# EAGLE design pH-metr (EAGLE 6.1)
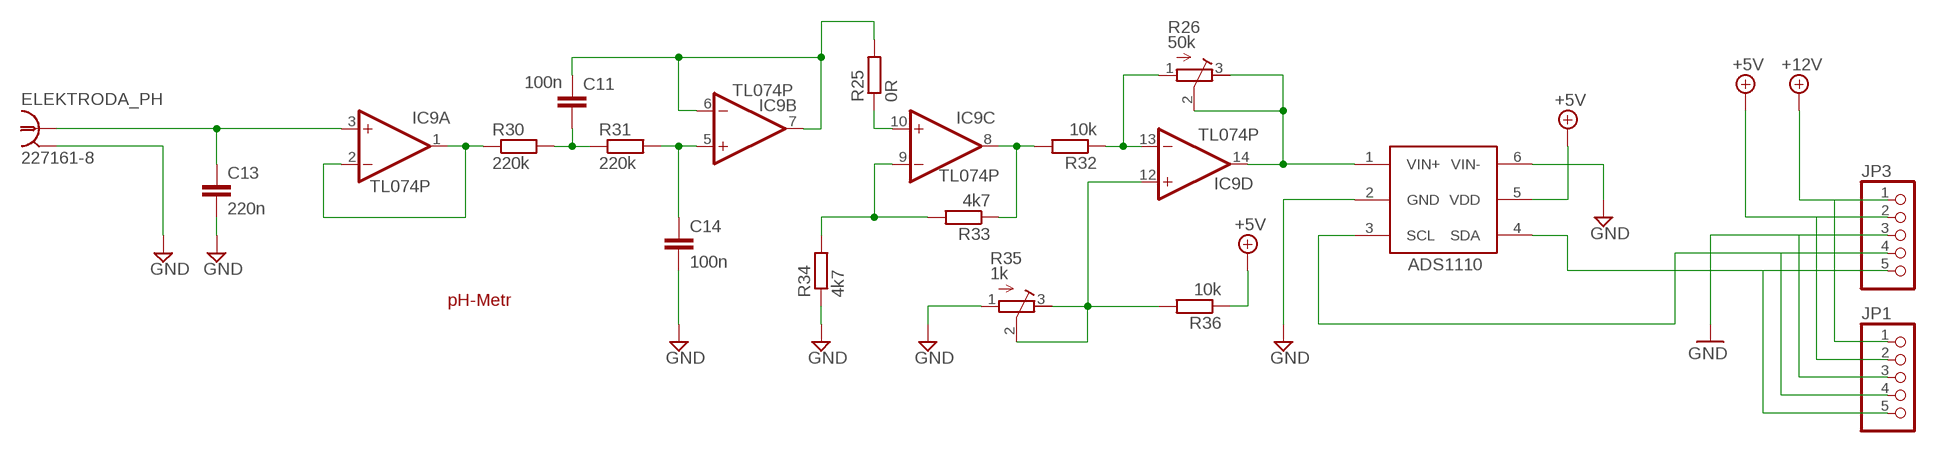
[diagram p0: schematic, sheet 1]

## Parts
C11  100n  C-EUC1206  [C1206]
C13  220n  C-EU050-025X075  [C050-025X075]
C14  100n  C-EUC1206  [C1206]
ELEKTRODA_PH  227161-8  [AMP_227161]
IC2  ADS1110  [SOT-23-6]
IC9  TL074P  [DIL14]
JP1  PINHD-1X5/90  [1X05/90]
JP3  PINHD-1X5/90  [1X05/90]
R25  0R  R-EU_R1206  [R1206]
R26  50k  R-TRIMM64X  [RTRIM64X]
R30  220k  R-EU_R1206  [R1206]
R31  220k  R-EU_R1206  [R1206]
R32  10k  R-EU_R1206  [R1206]
R33  4k7  R-EU_R1206  [R1206]
R34  4k7  R-EU_R1206  [R1206]
R35  1k  R-TRIMM64X  [RTRIM64X]
R36  10k  R-EU_R1206  [R1206]

## Nets
+5V: IC2.5(VDD) JP1.2 JP3.2 R36.1
+12V: JP1.1 JP3.1
GND: C13.2 C14.2 ELEKTRODA_PH.2(GND) IC2.2(GND) IC2.6(VIN-) JP1.3 JP3.3 R34.1 R35.1(A)
N$46: C13.1 ELEKTRODA_PH.1 IC9.3(A:+IN)
N$47: IC9.12(D:+IN) R35.2(S) R35.3(E) R36.2
N$51: IC9.10(C:+IN) R25.1
N$94: IC9.13(D:-IN) R26.1(A) R32.1
N$96: IC9.1(A:OUT) IC9.2(A:-IN) R30.1
N$100: C11.2 R30.2 R31.1
N$102: C14.1 IC9.5(B:+IN) R31.2
N$104: C11.1 IC9.6(B:-IN) IC9.7(B:OUT) R25.2
N$109: IC9.9(C:-IN) R33.2 R34.2
N$110: IC9.8(C:OUT) R32.2 R33.1
PHOUT: IC2.1(VIN+) IC9.14(D:OUT) R26.2(S) R26.3(E)
SCL: IC2.3(SCL) JP1.4 JP3.4
SDA: IC2.4(SDA) JP1.5 JP3.5

## Notes on the sheet
- pH-Metr

## Power pins joined to a net without a drawn wire
V+: IC9.4(P:V+)
V-: IC9.11(P:V-)

## Library data of the parts
C11 C13 C14 = rcl:C-EU: CAPACITOR, European symbol
ELEKTRODA_PH = con-coax:?227161*: JACK, RIGHT ANGLE, 50 OHM, PCB, BNC Source: amp_227161.pdf; OC_FARNELL: unknown; OC_NEWARK: unknown
IC2 = ads11xx:ADS1110: Analog/Digital conventer i2c Bus max: 2.048v
IC9 = linear:TL074: OP AMP
JP1 JP3 = pinhead:PINHD-1X5: PIN HEADER
R25 R30-R34 R36 = rcl:R-EU_: RESISTOR, European symbol
R26 R35 = rcl:R-TRIMM: Trimm resistor

## Board
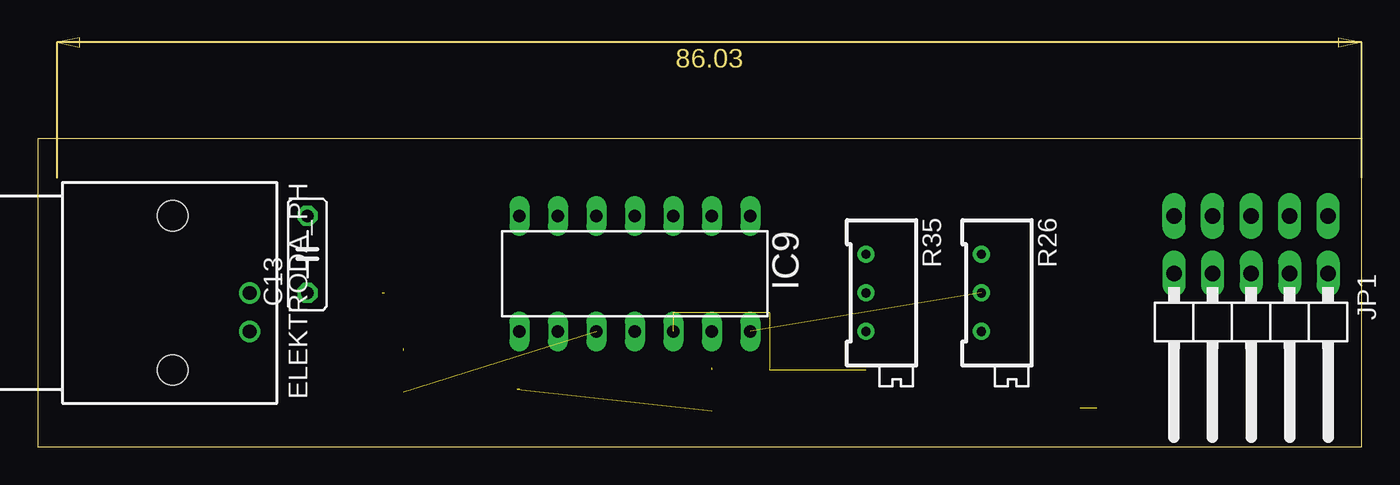
[diagram p1: board, top side]
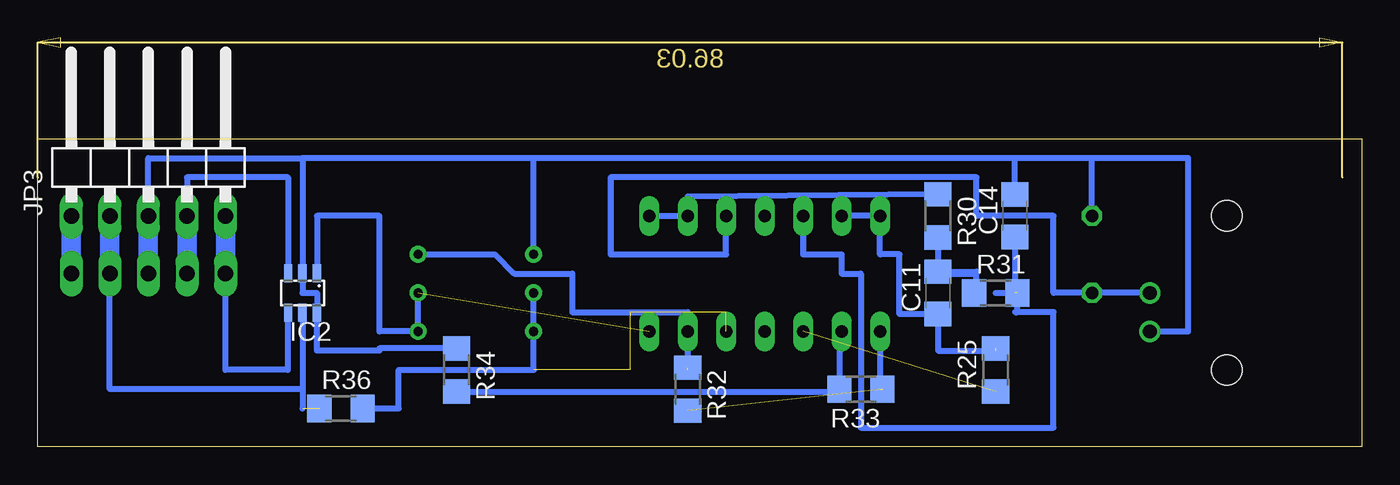
[diagram p2: board, bottom side, seen from below]

Size 87.3 x 20.31 mm. Coordinates in mm from the lower left corner, seen from the top.
Outline: 0,0 87.3,0 87.3,20.31 0,20.31 0,0
Copper layers (1*16): Top 0.035mm / dielectric 1.5mm / Bottom 0.035mm
Design rules: minimum track width 10mil, minimum drill 24mil, track to track 8mil, track to pad 8mil, pad to pad 8mil, via to via 8mil, smd to smd 8mil, copper to edge 40mil, drill to drill 8mil, minimum pad ring 10mil, minimum via ring 8mil, stop-mask expansion 4mil, vias tented up to drill 0mil, thermal gap 10mil

### Footprints (pad centres in the part's own frame; a part is rotated, then mirrored left to right if it is on the bottom)
C1206 = smd 1.6 x 1.8: 1 -1.4,0; 2 1.4,0
C050-025X075 = drill 0.813 octagon: 1 -2.54,0; 2 2.54,0
AMP_227161 = drill 0.9 pad 1.27: 1 0,-5.08; 2 -2.54,-5.08 | hole 2: -5.08,0; 5.08,0
SOT-23-6 = smd 0.55 x 1.2: 1 -0.95,-1.3; 2 0,-1.3; 3 0.95,-1.3; 4 0.95,1.3; 5 0,1.3; 6 -0.95,1.3
DIL14 = drill 0.813 long: 1 -7.62,-3.81; 2 -5.08,-3.81; 3 -2.54,-3.81; 4 0,-3.81; 5 2.54,-3.81; 6 5.08,-3.81; 7 7.62,-3.81; 8 7.62,3.81; 9 5.08,3.81; 10 2.54,3.81; 11 0,3.81; 12 -2.54,3.81; 13 -5.08,3.81; 14 -7.62,3.81
1X05/90 = drill 1.016 long: 1 -5.08,-3.81; 2 -2.54,-3.81; 3 0,-3.81; 4 2.54,-3.81; 5 5.08,-3.81
R1206 = smd 1.6 x 1.803: 1 -1.422,0; 2 1.422,0
RTRIM64X = drill 0.61: 1 1.27,-2.54; 2 1.27,0; 3 1.27,2.54

### Placement (x,y rotation side)
C11  27.94,10.16 90 bottom
C13  17.78,12.7 90 top
C14  22.86,15.24 90 bottom
ELEKTRODA_PH  8.89,10.16 90 top
IC2  69.85,10.16 180 bottom
IC9  39.37,11.43 180 top
JP1  80.01,7.62 180 top
JP3  80.01,19.05 0 bottom
R25  24.13,5.08 90 bottom
R26  63.5,10.16 180 top
R30  27.94,15.24 270 bottom
R31  24.13,10.16 0 bottom
R32  44.45,3.81 270 bottom
R33  33.02,3.81 180 bottom
R34  59.69,5.08 270 bottom
R35  55.88,10.16 180 top
R36  67.31,2.54 0 bottom

### Tracks (layer width: path | path; a pad name or v marks a point on that pad's centre or on a via)
+5V  (1 unrouted)
  Bottom 0.406: IC2.5 69.85,3.81 | 69.85,3.81 82.55,3.81 JP1.2 | 69.85,3.81 69.85,2.54
  Bottom 1.27: JP3.2 JP1.2
+12V
  Bottom 1.27: JP3.1 JP1.1
GND
  Bottom 0.406: JP3.3 80.01,19.05 69.85,19.05 | 69.85,19.05 IC2.2 69.85,10.16 68.9,10.16 IC2.6 68.9,6.35 64.77,6.35 64.77,6.5 R34.1 | ELEKTRODA_PH.2 11.43,7.62 11.43,19.05 17.78,19.05 | 17.78,19.05 22.86,19.05 | 22.86,19.05 54.61,19.05 | R35.1 54.61,19.05 | 54.61,19.05 69.85,19.05 | C13.2 17.78,19.05 | C14.2 22.86,19.05
  Bottom 1.27: JP3.3 JP1.3
N$46
  Bottom 0.406: ELEKTRODA_PH.1 C13.1 20.32,10.16 20.32,15.24 25.4,15.24 25.4,17.78 49.53,17.78 49.53,12.7 41.91,12.7 IC9.3
N$47  (4 unrouted)
  Bottom 0.406: R36.2 63.5,2.54 63.5,5.08 54.61,5.08 R35.3 R35.2
N$51  (1 unrouted)
N$94  (1 unrouted)
  Bottom 0.406: R26.1 57.15,12.7 55.88,11.43 52.07,11.43 52.07,8.89 44.45,8.89 IC9.13 44.45,5.08
N$96
  Bottom 0.406: IC9.1 IC9.2 44.45,16.51 R30.1
N$100
  Bottom 0.406: R30.2 C11.2 | C11.2 27.94,11.43 25.4,11.43 | C11.2 25.4,11.56 R31.1
N$102  (1 unrouted)
  Bottom 0.406: C14.1 22.86,10.16 24.13,10.16 | IC9.5 36.83,12.7 34.29,12.7 34.29,11.43 33.02,11.43 33.02,1.27 20.32,1.27 20.32,8.89 22.71,8.89 | 22.86,8.89 22.71,8.89 | 22.71,8.89 R31.2
N$104  (1 unrouted)
  Bottom 0.406: IC9.6 IC9.7 31.75,12.7 30.48,12.7 30.48,8.76 C11.1 27.94,6.35 24.13,6.35
N$109
  Bottom 0.406: IC9.9 34.44,7.62 R33.2 34.44,3.66 R34.2
N$110  (2 unrouted)
  Bottom 0.406: IC9.8 31.75,3.81
PHOUT  (1 unrouted)
  Bottom 0.406: IC2.1 68.9,15.24 64.77,15.24 64.77,7.62 R26.3 R26.2
SCL
  Bottom 0.406: IC2.3 70.8,17.78 77.47,17.78 JP3.4
  Bottom 1.27: JP3.4 JP1.4
SDA
  Bottom 0.406: IC2.4 70.8,5.08 74.93,5.08 JP1.5
  Bottom 1.27: JP3.5 JP1.5

### Text on the board
Bottom: v 2.0 | AquaPI